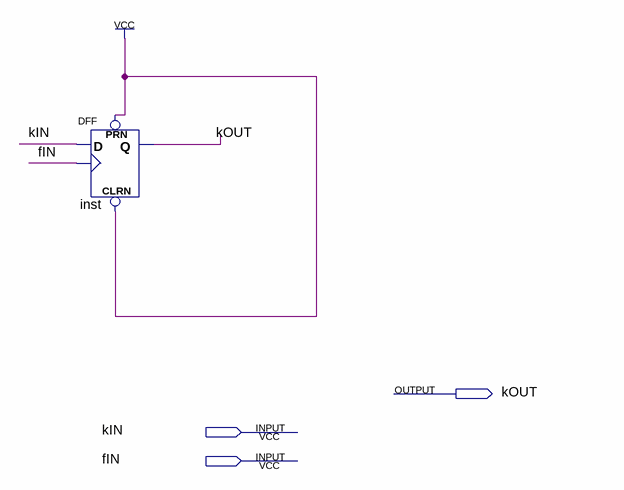
[diagram p0: schematic sheet]
// Quartus schematic xiaochan.bdf as structural Verilog: 1 symbols, 3 pins
module xiaochan (
  input  kIN,
  input  fIN,
  output kOUT
);

  DFF inst (.CLRN(1'b1), .CLK(fIN), .D(kIN), .PRN(1'b1), .Q(kOUT));
endmodule
